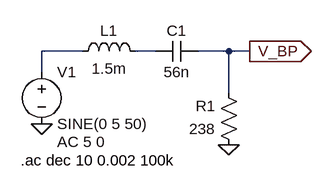
[diagram p0: schematic Band_Pass_RLC_filter.asc]
Band_Pass_RLC_filter.asc, the LTspice schematic file:
Version 4.1
SHEET 1 880 680
WIRE 80 112 16 112
WIRE 192 112 160 112
WIRE 304 112 256 112
WIRE 336 112 304 112
WIRE 16 144 16 112
WIRE 304 176 304 112
FLAG 304 256 0
FLAG 16 224 0
FLAG 336 112 V_BP
IOPIN 336 112 Out
SYMBOL cap 256 96 R90
WINDOW 0 0 32 VBottom 2
WINDOW 3 32 32 VTop 2
SYMATTR InstName C1
SYMATTR Value 56n
SYMBOL res 320 272 R180
WINDOW 0 36 76 Left 2
WINDOW 3 36 40 Left 2
SYMATTR InstName R1
SYMATTR Value 238
SYMBOL ind 64 128 R270
WINDOW 0 32 56 VTop 2
WINDOW 3 5 56 VBottom 2
SYMATTR InstName L1
SYMATTR Value 1.5m
SYMATTR SpiceLine Rser=1m
SYMBOL voltage 16 128 R0
WINDOW 123 24 124 Left 2
WINDOW 39 0 0 Left 0
SYMATTR InstName V1
SYMATTR Value SINE(0 5 50)
SYMATTR Value2 AC 5 0
TEXT -16 280 Left 2 !.ac dec 10 0.002 100k

The netlist it stands for:
* Band_Pass_RLC_filter.asc
C1 V_BP N002 56n
R1 0 V_BP 238
L1 N001 N002 1.5m Rser=1m
V1 N001 0 SINE(0 5 50) AC 5 0
.ac dec 10 0.002 100k
.backanno
.end